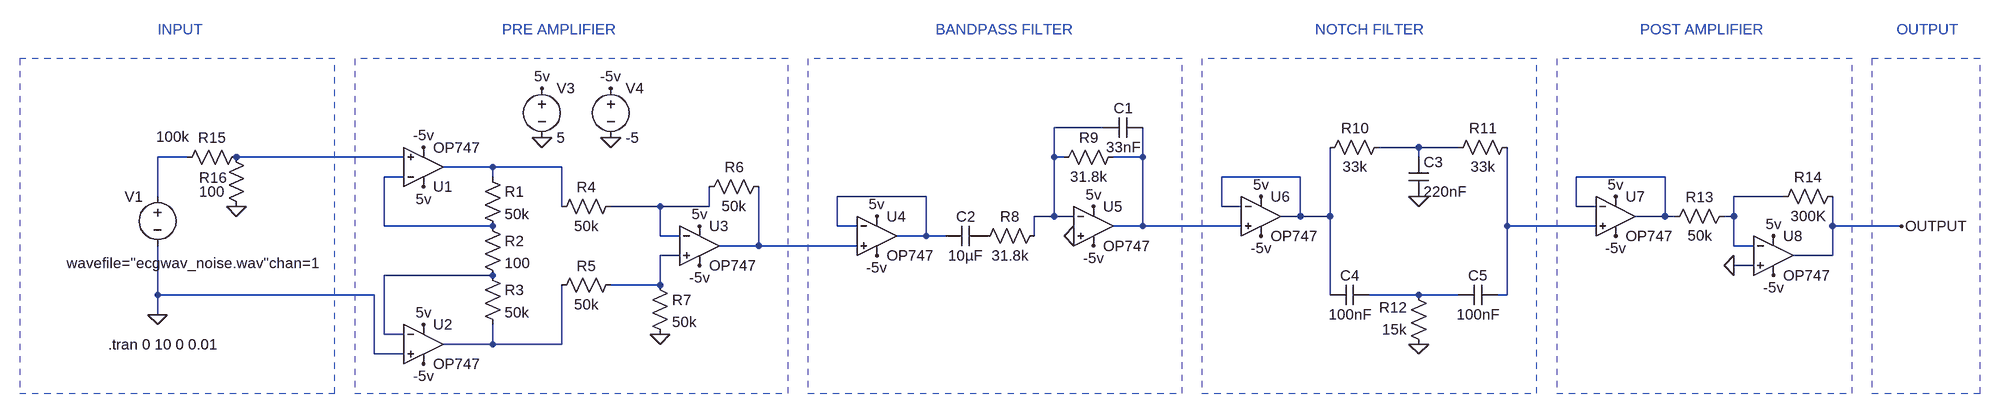
[diagram p0: schematic Main Project.asc]
Main Project.asc, the LTspice schematic file:
Version 4
SHEET 1 2996 680
WIRE 1264 -608 1184 -608
WIRE 1776 -576 1712 -576
WIRE 1840 -576 1776 -576
WIRE -224 -560 -272 -560
WIRE 128 -560 -144 -560
WIRE 1184 -560 1184 -608
WIRE 1200 -560 1184 -560
WIRE 1328 -560 1328 -608
WIRE 1328 -560 1280 -560
WIRE 1776 -560 1776 -576
WIRE 272 -544 192 -544
WIRE 384 -544 272 -544
WIRE 128 -528 96 -528
WIRE 272 -528 272 -544
WIRE 1584 -528 1456 -528
WIRE 2176 -528 2032 -528
WIRE -272 -496 -272 -560
WIRE 976 -496 832 -496
WIRE 2368 -496 2288 -496
WIRE 384 -480 384 -544
WIRE 544 -480 464 -480
WIRE 624 -480 624 -512
WIRE 624 -480 544 -480
WIRE 1456 -480 1456 -528
WIRE 1488 -480 1456 -480
WIRE 2032 -480 2032 -528
WIRE 2064 -480 2032 -480
WIRE 1184 -464 1184 -560
WIRE 1184 -464 1152 -464
WIRE 1216 -464 1184 -464
WIRE 1584 -464 1584 -528
WIRE 1584 -464 1552 -464
WIRE 1632 -464 1632 -576
WIRE 1632 -464 1584 -464
WIRE 2176 -464 2176 -528
WIRE 2176 -464 2128 -464
WIRE 2192 -464 2176 -464
WIRE 2288 -464 2288 -496
WIRE 2288 -464 2272 -464
WIRE 96 -448 96 -528
WIRE 272 -448 96 -448
WIRE 832 -448 832 -496
WIRE 864 -448 832 -448
WIRE 1328 -448 1328 -560
WIRE 1328 -448 1280 -448
WIRE 1488 -448 1328 -448
WIRE 1920 -448 1920 -576
WIRE 2064 -448 1920 -448
WIRE 2448 -448 2448 -496
WIRE 2560 -448 2448 -448
WIRE 544 -432 544 -480
WIRE 576 -432 544 -432
WIRE 976 -432 976 -496
WIRE 976 -432 928 -432
WIRE 1008 -432 976 -432
WIRE 1152 -432 1152 -464
WIRE 704 -416 704 -512
WIRE 704 -416 640 -416
WIRE 864 -416 704 -416
WIRE 2288 -416 2288 -464
WIRE 2320 -416 2288 -416
WIRE 576 -400 544 -400
WIRE 2448 -400 2448 -448
WIRE 2448 -400 2384 -400
WIRE 2320 -384 2288 -384
WIRE 272 -368 96 -368
WIRE 544 -352 544 -400
WIRE 544 -352 464 -352
WIRE -272 -336 -272 -416
WIRE 80 -336 -272 -336
WIRE 1632 -336 1632 -464
WIRE 1776 -336 1696 -336
WIRE 1840 -336 1776 -336
WIRE 1920 -336 1920 -448
WIRE 1920 -336 1904 -336
WIRE -272 -304 -272 -336
WIRE 96 -272 96 -368
WIRE 128 -272 96 -272
WIRE 272 -256 272 -288
WIRE 272 -256 192 -256
WIRE 384 -256 384 -352
WIRE 384 -256 272 -256
WIRE 80 -240 80 -336
WIRE 128 -240 80 -240
FLAG 464 -592 0
FLAG 352 -592 0
FLAG 352 -672 5v
FLAG 160 -576 -5v
FLAG 160 -288 5v
FLAG 608 -448 5v
FLAG 464 -672 -5v
FLAG 608 -384 -5v
FLAG 160 -224 -5v
FLAG 160 -512 5v
FLAG -272 -304 0
FLAG 544 -272 0
FLAG 1776 -256 0
FLAG 1776 -496 0
FLAG 2352 -432 5v
FLAG 2352 -368 -5v
FLAG 2288 -384 0
FLAG 2560 -448 OUTPUT
FLAG 896 -464 5v
FLAG 1248 -480 5v
FLAG 1520 -496 5v
FLAG 2096 -496 5v
FLAG 2096 -432 -5v
FLAG 1520 -432 -5v
FLAG 1248 -416 -5v
FLAG 896 -400 -5v
FLAG -144 -480 0
FLAG 1216 -432 0
SYMBOL voltage -272 -512 M0
WINDOW 123 0 0 Left 0
WINDOW 39 0 0 Left 0
WINDOW 3 -253 124 Left 2
SYMATTR Value wavefile="ecgwav_noise.wav"chan=1
SYMATTR InstName V1
SYMBOL OpAmps\\OP747 160 -480 M180
SYMATTR InstName U1
SYMBOL OpAmps\\OP747 160 -320 R0
SYMATTR InstName U2
SYMBOL res 256 -544 R0
SYMATTR InstName R1
SYMATTR Value 50k
SYMBOL res 256 -464 R0
SYMATTR InstName R2
SYMATTR Value 100
SYMBOL res 256 -384 R0
SYMATTR InstName R3
SYMATTR Value 50k
SYMBOL res 480 -496 R90
WINDOW 0 0 56 VBottom 2
WINDOW 3 32 56 VTop 2
SYMATTR InstName R4
SYMATTR Value 50k
SYMBOL res 480 -368 R90
WINDOW 0 0 56 VBottom 2
WINDOW 3 32 56 VTop 2
SYMATTR InstName R5
SYMATTR Value 50k
SYMBOL OpAmps\\OP747 608 -480 R0
SYMATTR InstName U3
SYMBOL res 720 -528 R90
WINDOW 0 0 56 VBottom 2
WINDOW 3 32 56 VTop 2
SYMATTR InstName R6
SYMATTR Value 50k
SYMBOL voltage 352 -688 R0
WINDOW 123 0 0 Left 0
WINDOW 39 0 0 Left 0
SYMATTR InstName V3
SYMATTR Value 5
SYMBOL voltage 464 -688 R0
WINDOW 123 0 0 Left 0
WINDOW 39 0 0 Left 0
SYMATTR InstName V4
SYMATTR Value -5
SYMBOL OpAmps\\OP747 896 -496 R0
SYMATTR InstName U4
SYMBOL res 528 -368 R0
SYMATTR InstName R7
SYMATTR Value 50k
SYMBOL cap 1008 -416 R270
WINDOW 0 32 32 VTop 2
WINDOW 3 0 32 VBottom 2
SYMATTR InstName C2
SYMATTR Value 10µF
SYMBOL OpAmps\\OP747 1248 -512 R0
SYMATTR InstName U5
SYMBOL res 1728 -592 R90
WINDOW 0 0 56 VBottom 2
WINDOW 3 32 56 VTop 2
SYMATTR InstName R10
SYMATTR Value 33k
SYMBOL res 1936 -592 R90
WINDOW 0 0 56 VBottom 2
WINDOW 3 32 56 VTop 2
SYMATTR InstName R11
SYMATTR Value 33k
SYMBOL res 1792 -240 R180
WINDOW 0 36 76 Left 2
WINDOW 3 36 40 Left 2
SYMATTR InstName R12
SYMATTR Value 15k
SYMBOL cap 1760 -560 R0
SYMATTR InstName C3
SYMATTR Value 220nF
SYMBOL cap 1696 -352 R90
WINDOW 0 0 32 VBottom 2
WINDOW 3 32 32 VTop 2
SYMATTR InstName C4
SYMATTR Value 100nF
SYMBOL cap 1904 -352 R90
WINDOW 0 0 32 VBottom 2
WINDOW 3 32 32 VTop 2
SYMATTR InstName C5
SYMATTR Value 100nF
SYMBOL OpAmps\\OP747 1520 -528 R0
SYMATTR InstName U6
SYMBOL OpAmps\\OP747 2096 -528 R0
SYMATTR InstName U7
SYMBOL res 2288 -480 R90
WINDOW 0 0 56 VBottom 2
WINDOW 3 32 56 VTop 2
SYMATTR InstName R13
SYMATTR Value 50k
SYMBOL OpAmps\\OP747 2352 -464 R0
SYMATTR InstName U8
SYMBOL res 2464 -512 R90
WINDOW 0 0 56 VBottom 2
WINDOW 3 32 56 VTop 2
SYMATTR InstName R14
SYMATTR Value 300K
SYMBOL res -128 -576 R90
WINDOW 0 0 56 VBottom 2
WINDOW 3 -33 120 VTop 2
SYMATTR InstName R15
SYMATTR Value 100k
SYMBOL res -128 -464 R180
WINDOW 0 32 63 Left 2
WINDOW 3 36 40 Left 2
SYMATTR InstName R16
SYMATTR Value 100
SYMBOL res 1168 -448 R90
WINDOW 0 0 56 VBottom 2
WINDOW 3 32 56 VTop 2
SYMATTR InstName R8
SYMATTR Value 31.8k
SYMBOL res 1296 -576 R90
WINDOW 0 0 56 VBottom 2
WINDOW 3 32 56 VTop 2
SYMATTR InstName R9
SYMATTR Value 31.8k
SYMBOL cap 1328 -624 R90
WINDOW 0 0 32 VBottom 2
WINDOW 3 32 32 VTop 2
SYMATTR InstName C1
SYMATTR Value 33nF
TEXT -352 -256 Left 2 !.tran 0 10 0 0.01
TEXT 288 -768 Left 2 ;PRE AMPLIFIER
TEXT 2136 -768 Left 2 ;POST AMPLIFIER
TEXT 992 -768 Left 2 ;BANDPASS FILTER
TEXT 1608 -768 Left 2 ;NOTCH FILTER
TEXT -272 -768 Left 2 ;INPUT
TEXT 2552 -768 Left 2 ;OUTPUT
RECTANGLE Normal -496 -176 16 -720 1
RECTANGLE Normal 48 -176 752 -720 1
RECTANGLE Normal 784 -176 1392 -720 1
RECTANGLE Normal 1424 -176 1968 -720 1
RECTANGLE Normal 2000 -176 2480 -720 1
RECTANGLE Normal 2512 -176 2688 -720 1

The netlist it stands for:
* Main Project.asc
V1 N003 0 wavefile="ecgwav_noise.wav"chan=1
XU1 N004 N007 5v -5v N006 OP747  ; pins In+ In- V+ V- OUT
XU2 0 N016 5v -5v N018 OP747  ; pins In+ In- V+ V- OUT
R1 N006 N007 50k
R2 N007 N016 100
R3 N016 N018 50k
R4 N012 N006 50k
R5 N015 N018 50k
XU3 N015 N012 5v -5v N014 OP747  ; pins In+ In- V+ V- OUT
R6 N014 N012 50k
V3 5v 0 5
V4 -5v 0 -5
XU4 N014 N010 5v -5v N010 OP747  ; pins In+ In- V+ V- OUT
R7 N015 0 50k
C2 N010 P001 10µF
XU5 0 N001 5v -5v N005 OP747  ; pins In+ In- V+ V- OUT
R10 N002 N008 33k
R11 N013 N002 33k
R12 0 N017 15k
C3 N002 0 220nF
C4 N017 N008 100nF
C5 N013 N017 100nF
XU6 N005 N008 5v -5v N008 OP747  ; pins In+ In- V+ V- OUT
XU7 N013 N009 5v -5v N009 OP747  ; pins In+ In- V+ V- OUT
R13 N011 N009 50k
XU8 0 N011 5v -5v OUTPUT OP747  ; pins In+ In- V+ V- OUT
R14 OUTPUT N011 300K
R15 N004 N003 100k
R16 0 N004 100
R8 N001 P001 31.8k
R9 N005 N001 31.8k
C1 N005 N001 33nF
.tran 0 10 0 0.01
* PRE AMPLIFIER
* POST AMPLIFIER
* BANDPASS FILTER
* NOTCH FILTER
* INPUT
* OUTPUT
.backanno
.end